# Altium project 28PinArduino.PrjPCB (part 2 of 3)
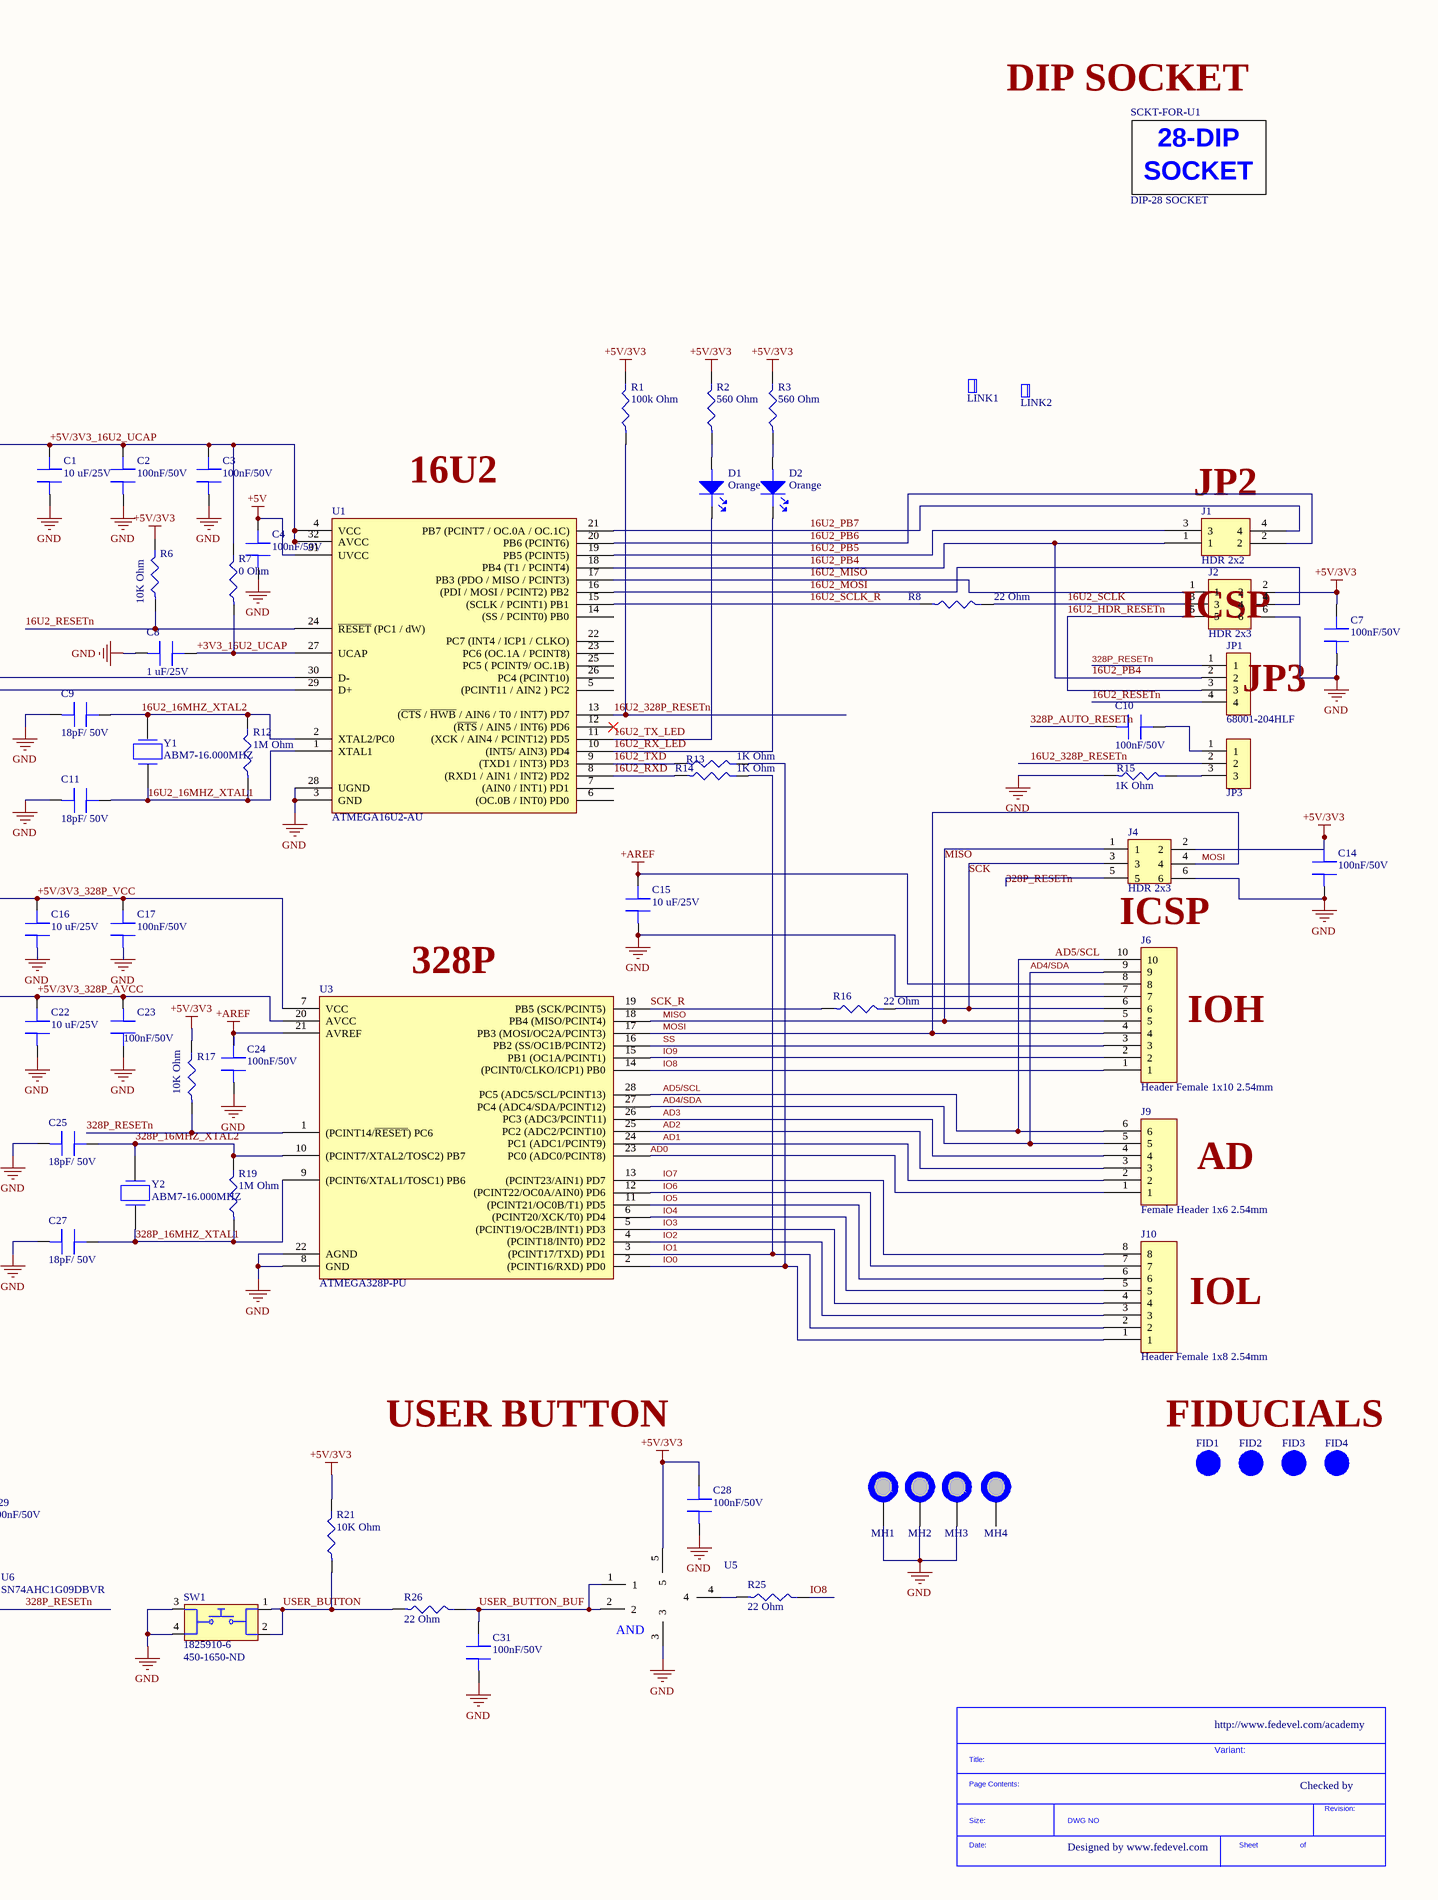
[diagram p5: [03] - 28PINS SCHEMATIC.SchDoc, right]

## Sheet [03] - 28PINS SCHEMATIC.SchDoc: 28 Pins (continued)
### Library data of the parts
C1 C12 C13 C15 C16 C21 C22 = C2012X5R1E106K125AB: TDK - C2012X5R1E106K125AB - Keramikvielschichtkondensator, SMD, 10 µF, 25 V, 0805 [Metrisch 2012], ± 10%, X5R, Baureihe C; Dielectric Material: Ceramic; Capacitance: 10uF; Voltage Rating: 25V; Supplier 1: Digi-Key; Manufacturer: TDK; Manufacturer Part Number: C2012X5R1E106K125AB; Stock 1: 101054; Pricing 1: 1=0.33, 10=0.231, 50=0.1618, 100=0.1386, 500=0.10396, 1000=0.08778 (USD); Mount: Surface Mount; Case/Package: 0805; Case Code (Metric): 2012; Case Code (Imperial): 0805; Weight: 0.000194oz; Min Operating Temperature: -55°C; Max Operating Temperature: 85°C; Tolerance: 10%; Packaging: Tape and Reel; Voltage Rating (DC): 25V; Package Quantity: 1; Dielectric: X5R; Termination: SMD/SMT; Resistor Type: Ceramic; Voltage: 25V; Series: C; Length: 2mm; Width: 0.049inch; Height: 1.25mm; Thickness: 0.057inch; Depth: 1.25mm; REACH SVHC: No SVHC; Lead Free: Lead Free; ComponentLink1URL: http://www.farnell.com/datasheets/1913358.pdf?src-supplier=Element14; ComponentLink1Description: http://www.farnell.com/datasheets/1913358.pdf?src-supplier=Element14; ComponentLink2URL: http://www.tdk.com/pdf/general_B11.pdf?src-supplier=Future+Electronics; ComponentLink2Description: http://www.tdk.com/pdf/general_B11.pdf?src-supplier=Future+Electronics; ComponentLink3URL: http://www.mouser.com/ds/2/400/lcc_commercial_general_en-837201.pdf?src-supplier=Mouser; ComponentLink3Description: http://www.mouser.com/ds/2/400/lcc_commercial_general_en-837201.pdf?src-supplier=Mouser; Supplier Part Number 1: 445-5984-1-ND
C2-C4 C7 C10 C14 C17-C20 C23 C24 C26 C28-C33 = C2012X7R1H104K085AA: TDK - C2012X7R1H104K085AA - SMD Multilayer Ceramic Capacitor, 0.1 µF, 50 V, 0805 [2012 Metric], ± 10%, X7R, C Series; Capacitance: 100nF; Voltage Rating: 50V; Supplier 1: Digi-Key; Manufacturer: TDK; Manufacturer Part Number: C2012X7R1H104K085AA; Stock 1: 405421; Pricing 1: 1=0.15, 10=0.104, 50=0.059, 100=0.0488, 500=0.03422, 1000=0.02833 (USD); Mount: Surface Mount; Case/Package: 0805; Number of Pins: 2; Case Code (Metric): 2012; Case Code (Imperial): 0805; Weight: 0.000194oz; Dielectric Material: Ceramic; Min Operating Temperature: -55°C; Max Operating Temperature: 125°C; Package Quantity: 1; Tolerance: 10%; Packaging: Tape and Reel; Voltage Rating (DC): 50V; Dielectric: X7R; Termination: SMD/SMT; Resistor Type: Ceramic; Voltage: 50V; Series: C; Construction: Flat; Length: 2mm; Width: 0.049inch; Height: 0.85mm; Thickness: 0.037inch; Depth: 1.25mm; Radiation Hardening: No; REACH SVHC: No SVHC; Lead Free: Lead Free; ComponentLink1URL: http://uk.rs-online.com/webdocs/1532/0900766b81532cd0.pdf?src-supplier=RSComponents; ComponentLink1Description: http://uk.rs-online.com/webdocs/1532/0900766b81532cd0.pdf?src-supplier=RSComponents; ComponentLink2URL: https://product.tdk.com/info/en/catalog/datasheets/mlcc_commercial_general_en.pdf?src-supplier=Digi-Key; ComponentLink2Description: https://product.tdk.com/info/en/catalog/datasheets/mlcc_commercial_general_en.pdf?src-supplier=Digi-Key; ComponentLink3URL: http://www.tdk.co.jp/tefe02/e412_c.pdf?src-supplier=Future+Electronics; ComponentLink3Description: http://www.tdk.co.jp/tefe02/e412_c.pdf?src-supplier=Future+Electronics; ComponentLink4URL: http://www.farnell.com/datasheets/1796654.pdf?src-supplier=Newark; ComponentLink4Description: http://www.farnell.com/datasheets/1796654.pdf?src-supplier=Newark; ComponentLink5URL: http://www.farnell.com/datasheets/1571323.pdf?src-supplier=Element14; ComponentLink5Description: http://www.farnell.com/datasheets/1571323.pdf?src-supplier=Element14; Supplier Part Number 1: 445-7534-1-ND
C5 C6 = EEE-1AA101WR: Cap Aluminum 100uF 10V 20% (5 X 5.4mm) SMD 50mA 1000 hr 85°C T/R; Manufacturer: Panasonic; Life (Hours): 1000Hour; Supplier 1: Digi-Key; Manufacturer Part Number: EEE-1AA101WR; Stock 1: 88008; Pricing 1: 1=0.35, 10=0.243, 50=0.1618, 100=0.1374, 500=0.09702 (USD); Mount: Surface Mount,PCB; Case/Package: Radial; Contact Plating: Tin; Min Operating Temperature: -40°C; Max Operating Temperature: 85°C; Capacitance: 100uF; Tolerance: 20%; Ripple Current: 50mA; Voltage Rating: 10V; Packaging: Tape and Reel; Package Quantity: 1; Voltage Rating (DC): 10V; Termination: SMD/SMT; Ripple Current (AC): 50mA; Series: S; Construction: Cylindrical; Diameter: 5mm; Length: 5.5mm; Height: 5.4mm; Height - Seated (Max): 0.213inch; Radiation Hardening: No; Lead Free: Lead Free; RoHS Compliant: Yes; REACH SVHC: Unknown; ComponentLink1URL: https://industrial.panasonic.com/cdbs/www-data/pdf/RDE0000/DME0000COL90.pdf?src-supplier=Avnet; ComponentLink1Description: https://industrial.panasonic.com/cdbs/www-data/pdf/RDE0000/DME0000COL90.pdf?src-supplier=Avnet; ComponentLink2URL: https://industrial.panasonic.com/cdbs/www-data/pdf/RDE0000/DME0000COL90.pdf?src-supplier=Mouser; ComponentLink2Description: https://industrial.panasonic.com/cdbs/www-data/pdf/RDE0000/DME0000COL90.pdf?src-supplier=Mouser; ComponentLink3URL: http://industrial.panasonic.com/www-data/pdf/ABA0000/ABA0000CE2.pdf?src-supplier=Future+Electronics; ComponentLink3Description: http://industrial.panasonic.com/www-data/pdf/ABA0000/ABA0000CE2.pdf?src-supplier=Future+Electronics; ComponentLink4URL: https://industrial.panasonic.com/cdbs/www-data/pdf/RDE0000/DME0000COL90.pdf?src-supplier=Allied+Electronics; ComponentLink4Description: https://industrial.panasonic.com/cdbs/www-data/pdf/RDE0000/DME0000COL90.pdf?src-supplier=Allied+Electronics; ComponentLink5URL: https://industrial.panasonic.com/cdbs/www-data/pdf/RDE0000/DME0000COL90.pdf?src-supplier=Verical; ComponentLink5Description: https://industrial.panasonic.com/cdbs/www-data/pdf/RDE0000/DME0000COL90.pdf?src-supplier=Verical; Supplier Part Number 1: PCE3867CT-ND
C8 = C2012X5R1E105K125AA: TDK - C2012X5R1E105K125AA - SMD Multilayer Ceramic Capacitor, 1 µF, 25 V, 0805 [2012 Metric], ± 10%, X5R, C Series; Capacitance: 1uF; Voltage Rating: 25V; Supplier 1: Digi-Key; Manufacturer: TDK; Manufacturer Part Number: C2012X5R1E105K125AA; Stock 1: 63925; Pricing 1: 1=0.23, 10=0.158, 50=0.095, 100=0.0803, 500=0.05492, 1000=0.04858 (USD); Mount: Surface Mount; Case/Package: 0805; Number of Pins: 2; Case Code (Metric): 2012; Case Code (Imperial): 0805; Dielectric Material: Ceramic; Weight: 0.000194oz; Min Operating Temperature: -55°C; Max Operating Temperature: 85°C; Tolerance: 10%; Packaging: Tape and Reel; Voltage Rating (DC): 25V; Dielectric: X5R; Termination: SMD/SMT; Construction: Flat; Package Quantity: 2000; Resistor Type: Ceramic; Voltage: 25V; Series: C; Length: 2mm; Width: 0.049inch; Height: 1.25mm; Depth: 1.25mm; Thickness: 0.057inch; Radiation Hardening: No; Lead Free: Lead Free; REACH SVHC: No SVHC; ComponentLink1URL: http://uk.rs-online.com/webdocs/1532/0900766b81532cd0.pdf?src-supplier=RSComponents; ComponentLink1Description: http://uk.rs-online.com/webdocs/1532/0900766b81532cd0.pdf?src-supplier=RSComponents; ComponentLink2URL: http://www.tdk.co.jp/tefe02/e412_c.pdf?src-supplier=Future+Electronics; ComponentLink2Description: http://www.tdk.co.jp/tefe02/e412_c.pdf?src-supplier=Future+Electronics; ComponentLink3URL: http://www.farnell.com/datasheets/1744655.pdf?src-supplier=Element14; ComponentLink3Description: http://www.farnell.com/datasheets/1744655.pdf?src-supplier=Element14; ComponentLink4URL: https://product.tdk.com/info/en/catalog/spec/mlccspec_commercial_general_midvoltage_en.pdf?src-supplier=Verical; ComponentLink4Description: https://product.tdk.com/info/en/catalog/spec/mlccspec_commercial_general_midvoltage_en.pdf?src-supplier=Verical; Supplier Part Number 1: 445-1419-1-ND
C9 C11 C25 C27 = C0805C180J5GACTU: CAP CER 18PF 50V C0G/NP0 0805; Manufacturer: KEMET; Dielectric Material: Ceramic; Tolerance: 5%; Dielectric: C0G; Temperature Coefficient: 30ppm/°C; Dissipation Factor: 0.1%; Supplier 1: Digi-Key; Manufacturer Part Number: C0805C180J5GACTU; Stock 1: 98283; Pricing 1: 1=0.12, 10=0.086, 50=0.049, 100=0.0407, 500=0.02852, 1000=0.02361 (USD); Mount: Surface Mount,PCB; Case/Package: 0805; Number of Pins: 2; Contact Plating: Tin,Matte; Contact Material: Tin; Case Code (Imperial): 0805; Case Code (Metric): 2012; Min Operating Temperature: -55°C; Max Operating Temperature: 125°C; Capacitance: 18pF; Packaging: Tape and Reel; Voltage: 50V; Termination: SMD/SMT; Voltage Rating (DC): 50V; Package Quantity: 1; Voltage Rating: 50V; Series: C; Construction: Flat; Length: 2mm; Width: 1.2mm; Height: 0.78mm; Depth: 1.25mm; Lead Pitch: 0.75mm; Thickness: 0.035inch; Radiation Hardening: No; Lead Free: Lead Free; REACH SVHC: No SVHC; ComponentLink1URL: http://www.farnell.com/datasheets/1769375.pdf?src-supplier=Element14; ComponentLink1Description: http://www.farnell.com/datasheets/1769375.pdf?src-supplier=Element14; ComponentLink2URL: https://www.verical.com/server-webapp/html/getDatasheet?partID=385668&src-supplier=Verical; ComponentLink2Description: https://www.verical.com/server-webapp/html/getDatasheet?partID=385668&src-supplier=Verical; ComponentLink3URL: https://www.verical.com/server-webapp/html/getDatasheet?partID=759702&src-supplier=Verical; ComponentLink3Description: https://www.verical.com/server-webapp/html/getDatasheet?partID=759702&src-supplier=Verical; Supplier Part Number 1: 399-1112-1-ND
D1-D3 = LOL29K-H2K1-24-Z: OSRAM - LO L29K-H2K1-24-Z - SMARTLED 0603 ORANGE; Manufacturer: Osram Opto; Lens Color: White; Forward Current: 20mA; Forward Voltage: 2.2V; Luminous Intensity: 9mcd; Viewing Angle: 160°; Lens Style: Flat,Diffused,Colorless,Rectangular; Test Current: 2mA; Dominant Wavelength: 606nm; Luminous Flux: 0.025lm; Number of LEDs: 1; Reverse Voltage: 12V; Lens Transparency: Diffused; Lens Size: 0.8mm; Supplier 1: Digi-Key; Manufacturer Part Number: LOL29K-H2K1-24-Z; Stock 1: 0; Mount: Surface Mount; Case/Package: 0603; Number of Pins: 2; Color: Orange; Case Code (Metric): 1608; Case Code (Imperial): 0603; Min Operating Temperature: -40°C; Max Operating Temperature: 100°C; Packaging: Tape and Reel; Number of Elements: 1; Series: SmartLED; Illumination Color: Orange; Package Quantity: 5000; Length: 1.3mm; Width: 0.8mm; Height: 0.65mm; Depth: 0.8mm; Radiation Hardening: No; ComponentLink1URL: https://dammedia.osram.info/media/resource/hires/osram-dam-2493882/LO%20L29K.pdf?src-supplier=Digi-Key; ComponentLink1Description: https://dammedia.osram.info/media/resource/hires/osram-dam-2493882/LO%20L29K.pdf?src-supplier=Digi-Key; ComponentLink2URL: https://www.verical.com/server-webapp/html/getDatasheet?partID=693885&src-supplier=Verical; ComponentLink2Description: https://www.verical.com/server-webapp/html/getDatasheet?partID=693885&src-supplier=Verical; Supplier Part Number 1: 475-2740-6-ND
D4 = LGL29K-G2J1-24-Z: LED Uni-Color Green 572nm 2-Pin Chip 0603(1608Metric) T/R; Manufacturer: Osram Opto; Lens Color: White; Forward Current: 20mA; Forward Voltage: 2.2V; Luminous Intensity: 5.6mcd; Viewing Angle: 160°; Lens Style: Flat,Diffused,Colorless,Rectangular; Test Current: 2mA; Dominant Wavelength: 570nm; Luminous Flux: 0.012lm; Number of LEDs: 1; Lens Transparency: Diffused; Reverse Voltage: 12V; Lens Size: 0.8mm; Supplier 1: Digi-Key; Manufacturer Part Number: LGL29K-G2J1-24-Z; Stock 1: 114683; Pricing 1: 1=0.47, 10=0.308, 100=0.2053, 500=0.14198, 1000=0.11832, 2000=0.10649 (USD); Mount: Surface Mount; Case/Package: 0603; Number of Pins: 2; Color: Green; Case Code (Metric): 1608; Case Code (Imperial): 0603; Min Operating Temperature: -40°C; Max Operating Temperature: 100°C; Illumination Color: Green; Packaging: Tape and Reel; Package Quantity: 5000; Number of Elements: 1; Series: SmartLED; Length: 1.3mm; Width: 0.8mm; Height: 0.65mm; Depth: 0.8mm; Radiation Hardening: No; ComponentLink1URL: http://www.mouser.com/ds/2/311/LG%20L29K%20-%20SMARTLED%200603-335234.pdf?src-supplier=Mouser; ComponentLink1Description: http://www.mouser.com/ds/2/311/LG%20L29K%20-%20SMARTLED%200603-335234.pdf?src-supplier=Mouser; ComponentLink2URL: https://dammedia.osram.info/media/resource/hires/osram-dam-2493945/LG%20L29K.pdf?src-supplier=Digi-Key; ComponentLink2Description: https://dammedia.osram.info/media/resource/hires/osram-dam-2493945/LG%20L29K.pdf?src-supplier=Digi-Key; ComponentLink3URL: https://www.verical.com/server-webapp/html/getDatasheet?partID=571127&src-supplier=Verical; ComponentLink3Description: https://www.verical.com/server-webapp/html/getDatasheet?partID=571127&src-supplier=Verical; Supplier Part Number 1: 475-2709-1-ND
D5 D6 = BAT54HT1G: Small Signal Schottky Diode, Single, 30 V, 200 mA, 800 mV, 600 mA, 150 C ;RoHS Compliant: Yes; Manufacturer: ON Semiconductor / Fairchild; Forward Voltage: 800mV; Forward Current: 200mA; Recovery Time: 5ns; Max Repetitive Reverse Voltage (Vrrm): 30V; Peak Non-Repetitive Surge Current: 600mA; Max Reverse Current: 2uA; Power Dissipation: 200mW; Polarity: Standard; Capacitance: 10pF; Supplier 1: Digi-Key; Manufacturer Part Number: BAT54HT1G; Stock 1: 286260; Pricing 1: 1=0.2, 10=0.141, 100=0.0759, 500=0.05962, 1000=0.0414 (USD); Mount: Surface Mount; Number of Pins: 2; Contact Plating: Tin,Matte; Min Operating Temperature: -55°C; Max Operating Temperature: 150°C; Packaging: Tape and Reel; Package Quantity: 3000; Average Rectified Current: 200mA; Reverse Recovery Time: 5ns; Max Forward Surge Current (Ifsm): 600mA; Element Configuration: Single; Max Reverse Voltage (DC): 30V; Max Surge Current: 600mA; Voltage Rating (DC): 30V; Current Rating: 200mA; Output Current: 200mA; Reverse Voltage: 30V; Max Reverse Leakage Current: 2uA; Length: 1.8mm; Width: 1.35mm; Height: 1mm; Radiation Hardening: No; Lead Free: Lead Free; REACH SVHC: No SVHC; ComponentLink1URL: http://www.fairchildsemi.com/datasheets/BA/BAT54HT1G.pdf?src-supplier=Digi-Key; ComponentLink1Description: http://www.fairchildsemi.com/datasheets/BA/BAT54HT1G.pdf?src-supplier=Digi-Key; ComponentLink2URL: http://www.farnell.com/datasheets/2251626.pdf?src-supplier=Element14; ComponentLink2Description: http://www.farnell.com/datasheets/2251626.pdf?src-supplier=Element14; ComponentLink3URL: http://www.jameco.com/Jameco/Products/ProdDS/806549.pdf?src-supplier=Jameco; ComponentLink3Description: http://www.jameco.com/Jameco/Products/ProdDS/806549.pdf?src-supplier=Jameco; ComponentLink4URL: http://www.farnell.com/datasheets/2251626.pdf?src-supplier=Newark; ComponentLink4Description: http://www.farnell.com/datasheets/2251626.pdf?src-supplier=Newark; ComponentLink5URL: http://www.mouser.com/ds/2/149/BAT54HT1G-104602.pdf?src-supplier=Mouser; ComponentLink5Description: http://www.mouser.com/ds/2/149/BAT54HT1G-104602.pdf?src-supplier=Mouser; ComponentLink6URL: http://www.farnell.com/datasheets/1727620.pdf?src-supplier=Element14; ComponentLink6Description: http://www.farnell.com/datasheets/1727620.pdf?src-supplier=Element14; ComponentLink7URL: https://media.digikey.com/pdf/Data%20Sheets/Fairchild%20PDFs/BAT54HT1G_Rev_1.2.pdf?src-supplier=Avnet; ComponentLink7Description: https://media.digikey.com/pdf/Data%20Sheets/Fairchild%20PDFs/BAT54HT1G_Rev_1.2.pdf?src-supplier=Avnet; ComponentLink8URL: http://www.onsemi.com/pub/Collateral/BAT54HT1-D.PDF?src-supplier=Avnet; ComponentLink8Description: http://www.onsemi.com/pub/Collateral/BAT54HT1-D.PDF?src-supplier=Avnet; ComponentLink9URL: http://www.onsemi.com/pub/Collateral/BAT54HT1-D.PDF?src-supplier=Digi-Key; ComponentLink9Description: http://www.onsemi.com/pub/Collateral/BAT54HT1-D.PDF?src-supplier=Digi-Key; ComponentLink10URL: http://uk.rs-online.com/webdocs/11a6/0900766b811a63a9.pdf?src-supplier=RSComponents; ComponentLink10Description: http://uk.rs-online.com/webdocs/11a6/0900766b811a63a9.pdf?src-supplier=RSComponents; ComponentLink11URL: https://media.digikey.com/pdf/Data%20Sheets/Fairchild%20PDFs/BAT54HT1G_Rev_1.2.pdf?src-supplier=Mouser; ComponentLink11Description: https://media.digikey.com/pdf/Data%20Sheets/Fairchild%20PDFs/BAT54HT1G_Rev_1.2.pdf?src-supplier=Mouser; ComponentLink12URL: http://www.fairchildsemi.com/ds/BA/BAT54HT1G.pdf?src-supplier=Future+Electronics; ComponentLink12Description: http://www.fairchildsemi.com/ds/BA/BAT54HT1G.pdf?src-supplier=Future+Electronics; ComponentLink13URL: http://www.produktinfo.conrad.com/datenblaetter/1200000-1299999/001262925-da-01-en-DIODE_SCHOTTKY_30V_BAT54HT1G_SOD_323_FSC.pdf?src-supplier=Conrad; ComponentLink13Description: http://www.produktinfo.conrad.com/datenblaetter/1200000-1299999/001262925-da-01-en-DIODE_SCHOTTKY_30V_BAT54HT1G_SOD_323_FSC.pdf?src-supplier=Conrad; Supplier Part Number 1: BAT54HT1GOSCT-ND
FB1-FB3 = MPZ2012S601AT000: FERRITE BEAD 600 OHM 0805 1LN; Manufacturer: TDK; Impedance: 600R; Current Rating: 2A; DC Resistance (DCR): 100mR; Supplier 1: Digi-Key; Manufacturer Part Number: MPZ2012S601AT000; Stock 1: 186163; Pricing 1: 1=0.11, 10=0.092, 25=0.0824, 50=0.0604, 100=0.0522, 250=0.04116, 500=0.03478, 1000=0.02928 (USD); Mount: Surface Mount; Case/Package: 0805; Case Code (Metric): 2012; Case Code (Imperial): 0805; Packaging: Tape and Reel; Package Quantity: 1; Max DC Current: 2A; Series: MPZ; Length: 0.079inch; Width: 0.049inch; Height: 0.041inch; REACH SVHC: No SVHC; Lead Free: Lead Free; ComponentLink1URL: https://media.digikey.com/pdf/Data%20Sheets/TDK%20PDFs/MPZ_Series_Br.pdf?src-supplier=Digi-Key; ComponentLink1Description: https://media.digikey.com/pdf/Data%20Sheets/TDK%20PDFs/MPZ_Series_Br.pdf?src-supplier=Digi-Key; ComponentLink2URL: https://product.tdk.com/info/en/catalog/datasheets/beads_commercial_power_mpz2012_en.pdf?src-supplier=Digi-Key; ComponentLink2Description: https://product.tdk.com/info/en/catalog/datasheets/beads_commercial_power_mpz2012_en.pdf?src-supplier=Digi-Key; Supplier Part Number 1: 445-2206-1-ND
FID1-FID4 = FID_1mm: Fiducial 40 mil Diameter 120mil Mask
J1 = 68602-204HLF: Manufacturer: Amphenol ICC / FCI; Supplier 1: Digi-Key; Manufacturer Part Number: 68602-204HLF; Stock 1: 1451; Pricing 1: 1=0.34, 10=0.319, 100=0.2232, 500=0.19132, 1000=0.15943, 5000=0.13665, 10000=0.12754 (USD); Supplier Part Number 1: 609-3369-ND
J2 J4 = 67997-106HLF: CONN HEADER 6POS .100 STR 30AU; Manufacturer: Amphenol FCI; Current Rating: 3A; Voltage Rating: 1.5kV; Number of Positions: 6; Insulation Resistance: 5GR; Gender: Male; Connector Type: Male Pin; Pitch: 2.54mm; Row Spacing: 0.1inch; Contact Post Length: 3.05mm; Supplier 1: Digi-Key; Manufacturer Part Number: 67997-106HLF; Stock 1: 1209; Pricing 1: 1=1.78, 10=1.614, 100=1.3837, 500=1.15308, 1000=0.98835, 5000=0.87634, 10000=0.85657 (USD); Mount: Through Hole; Contact Plating: Gold,GXT; Contact Material: Bronze; Color: Black; Housing Color: Black; Housing Material: Thermoplastic; Min Operating Temperature: -65°C; Max Operating Temperature: 125°C; Packaging: Bulk; Number of Rows: 2; Package Quantity: 100; Contact Gender: Male; Termination: Through Hole; Number of Contacts: 6; Max Voltage Rating (AC): 1.5kV; Orientation: Straight; Series: 67997; Contact Type: Male Pin; Length: 7.62mm; Contact Mating Length: 0.23inch; Depth: 4.83mm; Radiation Hardening: No; REACH SVHC: No SVHC; Lead Free: Lead Free; Flammability Rating: UL94 V-0; ComponentLink1URL: https://cdn.amphenol-icc.com/media/wysiwyg/files/drawing/67996.pdf?src-supplier=Avnet; ComponentLink1Description: https://cdn.amphenol-icc.com/media/wysiwyg/files/drawing/67996.pdf?src-supplier=Avnet; ComponentLink2URL: https://cdn.amphenol-icc.com/media/wysiwyg/files/drawing/67996.pdf?src-supplier=Digi-Key; ComponentLink2Description: https://cdn.amphenol-icc.com/media/wysiwyg/files/drawing/67996.pdf?src-supplier=Digi-Key; ComponentLink3URL: https://cdn.amphenol-icc.com/media/wysiwyg/files/drawing/67996.pdf?src-supplier=Mouser; ComponentLink3Description: https://cdn.amphenol-icc.com/media/wysiwyg/files/drawing/67996.pdf?src-supplier=Mouser; ComponentLink4URL: https://cdn.amphenol-icc.com/media/wysiwyg/files/drawing/67996.pdf?src-supplier=Avnet+Europe; ComponentLink4Description: https://cdn.amphenol-icc.com/media/wysiwyg/files/drawing/67996.pdf?src-supplier=Avnet+Europe; Supplier Part Number 1: 609-3393-ND
J3 = 10118193-0001LF: CONN USB MICRO B RECPT SMT R/A; Manufacturer: Amphenol FCI; Number of Terminals/Pins: 5; Gender: Female; Connector Type: USB,Receptacle; Number of Ports: 1; Current Rating: 1.8A; Insulation Resistance: 1GR; Max Voltage Rating (AC): 100V; Pitch: 0.65mm; Supplier 1: Digi-Key; Manufacturer Part Number: 10118193-0001LF; Stock 1: 7229; Pricing 1: 1=0.48, 10=0.451, 25=0.3868, 50=0.3286, 100=0.3158, 250=0.2836, 500=0.2707 (USD); Mount: Surface Mount,Horizontal; Contact Plating: Gold; Contact Material: Copper Alloy; Color: Black; Housing Material: Polymer; Min Operating Temperature: -55°C; Max Operating Temperature: 85°C; Termination: Solder; Packaging: Tape and Reel; Number of Contacts: 5; Orientation: Right Angle; Package Quantity: 1200; Voltage Rating: 100V; Features: Shielded; Series: -; Length: 7.86mm; Depth: 5.67mm; Radiation Hardening: No; Flammability Rating: UL94 V-0; ComponentLink1URL: https://cdn.amphenol-icc.com/media/wysiwyg/files/documentation/datasheet/inputoutput/io_usb_micro.pdf?src-supplier=Digi-Key; ComponentLink1Description: https://cdn.amphenol-icc.com/media/wysiwyg/files/documentation/datasheet/inputoutput/io_usb_micro.pdf?src-supplier=Digi-Key; ComponentLink2URL: https://cdn.amphenol-icc.com/media/wysiwyg/files/documentation/datasheet/inputoutput/io_usb_micro.pdf?src-supplier=Arrow+Electronics; ComponentLink2Description: https://cdn.amphenol-icc.com/media/wysiwyg/files/documentation/datasheet/inputoutput/io_usb_micro.pdf?src-supplier=Arrow+Electronics; ComponentLink3URL: http://www.amphenol-icc.com/media/wysiwyg/files/drawing/10118193.pdf?src-supplier=Digi-Key; ComponentLink3Description: http://www.amphenol-icc.com/media/wysiwyg/files/drawing/10118193.pdf?src-supplier=Digi-Key; ComponentLink4URL: https://cdn.amphenol-icc.com/media/wysiwyg/files/documentation/datasheet/inputoutput/io_usb_micro.pdf?src-supplier=Verical; ComponentLink4Description: https://cdn.amphenol-icc.com/media/wysiwyg/files/documentation/datasheet/inputoutput/io_usb_micro.pdf?src-supplier=Verical; ComponentLink5URL: https://cdn.amphenol-icc.com/media/wysiwyg/files/documentation/datasheet/inputoutput/io_usb_micro.pdf?src-supplier=Allied+Electronics; ComponentLink5Description: https://cdn.amphenol-icc.com/media/wysiwyg/files/documentation/datasheet/inputoutput/io_usb_micro.pdf?src-supplier=Allied+Electronics; ComponentLink6URL: https://cdn.amphenol-icc.com/media/wysiwyg/files/documentation/datasheet/inputoutput/io_usb_micro.pdf?src-supplier=Mouser; ComponentLink6Description: https://cdn.amphenol-icc.com/media/wysiwyg/files/documentation/datasheet/inputoutput/io_usb_micro.pdf?src-supplier=Mouser; Supplier Part Number 1: 609-4616-1-ND
J5 J7 = PAD_WITH_HOLE: Pad with a hole
J6 = M20-7821046: HARWIN - M20-7821046 - Board-To-Board Connector, M20 Series, Through Hole, Receptacle, 10, 2.54 mm, Tin Plated Contacts; Current Rating: 3A; Number of Positions: 10; Contact Resistance: 20mR; Insulation Resistance: 1MR; Mating Cycles: 50; Hole Diameter: 0.8mm; Supplier 1: Digi-Key; Manufacturer: Harwin; Manufacturer Part Number: M20-7821046; Stock 1: 645; Pricing 1: 1=1.13, 10=0.997, 100=0.8602, 500=0.7038, 1000=0.6256, 5000=0.5474, 10000=0.52003 (USD); Mount: Through Hole; Case/Package: SIL; Color: Black; Contact Plating: Tin; Contact Material: Bronze; Housing Material: Polyamide; Housing Color: Black; Min Operating Temperature: -40°C; Max Operating Temperature: 105°C; Packaging: Rail/Tube; Number of Rows: 1; Package Quantity: 23; Connector Type: Receptacle; Termination: Solder; Series: M20; Contact Type: Female Socket; Number of Contacts: 10; Gender: Receptacle; Max Current Rating: 3A; Orientation: Straight; Contact Gender: Female; Length: 25.8mm; Pitch: 2.54mm; Depth: 2.5mm; Lead Pitch: 2.54mm; Radiation Hardening: No; REACH SVHC: No SVHC; ComponentLink1URL: https://www.verical.com/server-webapp/html/getDatasheet?partID=559226&src-supplier=Verical; ComponentLink1Description: https://www.verical.com/server-webapp/html/getDatasheet?partID=559226&src-supplier=Verical; ComponentLink2URL: https://cdn.harwin.com/pdfs/M20-782.pdf?src-supplier=Digi-Key; ComponentLink2Description: https://cdn.harwin.com/pdfs/M20-782.pdf?src-supplier=Digi-Key; ComponentLink3URL: http://www.harwin.com/include/downloads/drawings/M20-782.PDF?src-supplier=Avnet; ComponentLink3Description: http://www.harwin.com/include/downloads/drawings/M20-782.PDF?src-supplier=Avnet; ComponentLink4URL: https://cdn.harwin.com/pdfs/Harwin_PC_Connectors_M20.pdf?src-supplier=Avnet+Europe; ComponentLink4Description: https://cdn.harwin.com/pdfs/Harwin_PC_Connectors_M20.pdf?src-supplier=Avnet+Europe; ComponentLink5URL: http://uk.rs-online.com/webdocs/1422/0900766b81422659.pdf?src-supplier=RSComponents; ComponentLink5Description: http://uk.rs-online.com/webdocs/1422/0900766b81422659.pdf?src-supplier=RSComponents; Supplier Part Number 1: 952-1847-ND
J8 J10 = M20-7820842: 2.54mm (0.1") Pitch SIL Vertical PC Tail Socket Assembly, selective gold + tin, 8 contacts; Manufacturer: Harwin; Number of Contacts: 8; Max Current Rating: 3A; Contact Resistance: 20mR; Connector Type: Receptacle; Supplier 1: Digi-Key; Manufacturer Part Number: M20-7820842; Stock 1: 344; Pricing 1: 1=1.17, 10=1.03, 100=0.8888, 500=0.7272, 1000=0.6464, 5000=0.5656, 10000=0.53732 (USD); Mount: Through Hole; Case/Package: SIL; Contact Plating: Tin,Gold; Color: Black; Contact Material: Bronze; Weight: 0.025397oz; Housing Color: Black; Housing Material: Polyamide; Min Operating Temperature: -40°C; Max Operating Temperature: 105°C; Number of Rows: 1; Termination: Solder; Contact Gender: Female; Package Quantity: 29; Packaging: Rail/Tube; Number of Positions: 8; Orientation: Straight; Gender: Female; Series: M20; Contact Type: Female Socket; Length: 20.72mm; Pitch: 2.54mm; Depth: 2.5mm; Radiation Hardening: No; ComponentLink1URL: https://cdn.harwin.com/pdfs/Harwin_PC_Connectors_M20.pdf?src-supplier=Avnet+Europe; ComponentLink1Description: https://cdn.harwin.com/pdfs/Harwin_PC_Connectors_M20.pdf?src-supplier=Avnet+Europe; ComponentLink2URL: http://www.harwin.com/include/downloads/drawings/M20-782.PDF?src-supplier=Avnet; ComponentLink2Description: http://www.harwin.com/include/downloads/drawings/M20-782.PDF?src-supplier=Avnet; Supplier Part Number 1: 952-1823-ND
J9 = M20-7820646: 06-WAY SIL VERT SOCKET L/FREE; Manufacturer: Harwin; Number of Contacts: 6; Max Current Rating: 3A; Contact Resistance: 20mR; Connector Type: Receptacle; Supplier 1: Digi-Key; Manufacturer Part Number: M20-7820646; Stock 1: 1716; Pricing 1: 1=1.01, 10=0.89, 100=0.7678, 500=0.6282, 1000=0.5584, 5000=0.4886, 10000=0.46417 (USD); Mount: Through Hole; Case/Package: SIL; Color: Black; Contact Plating: Tin; Contact Material: Bronze; Housing Color: Black; Housing Material: Nylon; Min Operating Temperature: -40°C; Max Operating Temperature: 105°C; Number of Rows: 1; Termination: Solder; Packaging: Rail/Tube; Contact Gender: Female; Package Quantity: 38; Number of Positions: 6; Orientation: Straight; Gender: Female; Series: M20; Contact Type: Female Socket; Length: 15.64mm; Pitch: 2.54mm; Depth: 2.5mm; Radiation Hardening: No; ComponentLink1URL: http://www.harwin.com/include/downloads/pdfs/2010PAGE120.PDF?src-supplier=Avnet; ComponentLink1Description: http://www.harwin.com/include/downloads/pdfs/2010PAGE120.PDF?src-supplier=Avnet; ComponentLink2URL: https://cdn.harwin.com/pdfs/M20-782.pdf?src-supplier=Newark; ComponentLink2Description: https://cdn.harwin.com/pdfs/M20-782.pdf?src-supplier=Newark; ComponentLink3URL: https://cdn.harwin.com/pdfs/M20-782.pdf?src-supplier=Digi-Key; ComponentLink3Description: https://cdn.harwin.com/pdfs/M20-782.pdf?src-supplier=Digi-Key; ComponentLink4URL: http://components.arrow.com/part/dataview/0323_00725884?src-supplier=Arrow+Europe; ComponentLink4Description: http://components.arrow.com/part/dataview/0323_00725884?src-supplier=Arrow+Europe; ComponentLink5URL: https://cdn.harwin.com/pdfs/Harwin_PC_Connectors_M20.pdf?src-supplier=Avnet+Europe; ComponentLink5Description: https://cdn.harwin.com/pdfs/Harwin_PC_Connectors_M20.pdf?src-supplier=Avnet+Europe; ComponentLink6URL: https://cdn.harwin.com/pdfs/Harwin_PC_Connectors_M20.pdf?src-supplier=Mouser; ComponentLink6Description: https://cdn.harwin.com/pdfs/Harwin_PC_Connectors_M20.pdf?src-supplier=Mouser; ComponentLink7URL: https://cdn.harwin.com/pdfs/Harwin_PC_Connectors_M20.pdf?src-supplier=RSComponents; ComponentLink7Description: https://cdn.harwin.com/pdfs/Harwin_PC_Connectors_M20.pdf?src-supplier=RSComponents; ComponentLink8URL: https://cdn.harwin.com/pdfs/M20-782.pdf?src-supplier=Farnell; ComponentLink8Description: https://cdn.harwin.com/pdfs/M20-782.pdf?src-supplier=Farnell; ComponentLink9URL: https://cdn.harwin.com/pdfs/Harwin_PC_Connectors_M20.pdf?src-supplier=TTI; ComponentLink9Description: https://cdn.harwin.com/pdfs/Harwin_PC_Connectors_M20.pdf?src-supplier=TTI; Supplier Part Number 1: 952-1809-ND
JP1 = 68001-204HLF: CONN HEADER VERT 4POS 2.54MM; Manufacturer: Amphenol FCI; Current Rating: 3A; Voltage Rating: 1.5kV; Number of Positions: 4; Insulation Resistance: 5GR; Gender: Male; Connector Type: Male Pin; Contact Post Length: 3.05mm; Supplier 1: Digi-Key; Manufacturer Part Number: 68001-204HLF; Stock 1: 2119; Pricing 1: 1=0.38, 10=0.357, 100=0.2501, 500=0.21442, 1000=0.17868, 5000=0.15315, 10000=0.14294 (USD); Mount: Through Hole; Color: Black; Contact Plating: Gold,GXT; Contact Material: Bronze; Housing Material: Thermoplastic; Min Operating Temperature: -65°C; Max Operating Temperature: 125°C; Package Quantity: 100; Number of Rows: 1; Packaging: Bulk; Contact Gender: Male; Termination: Solder; Number of Contacts: 4; Orientation: Straight; Series: BERGSTIK® II, MezzSelect™, Basics+; Contact Type: Male Pin; Pitch: 2.54mm; Contact Mating Length: 0.23inch; Radiation Hardening: No; Flammability Rating: UL94 V-0; ComponentLink1URL: https://cdn.amphenol-icc.com/media/wysiwyg/files/drawing/68000.pdf?src-supplier=Digi-Key; ComponentLink1Description: https://cdn.amphenol-icc.com/media/wysiwyg/files/drawing/68000.pdf?src-supplier=Digi-Key; ComponentLink2URL: https://cdn.amphenol-icc.com/media/wysiwyg/files/drawing/68000.pdf?src-supplier=Mouser; ComponentLink2Description: https://cdn.amphenol-icc.com/media/wysiwyg/files/drawing/68000.pdf?src-supplier=Mouser; Supplier Part Number 1: 609-3402-ND
JP2 JP3 = 68000-103HLF: AMPHENOL ICC - 68000-103HLF - Board-To-Board Connector, 2.54 mm, 3 Contacts, Header, FCI BergStik II 68000 Series, Through Hole; Supplier 1: Digi-Key; Manufacturer: Amphenol ICC; Manufacturer Part Number: 68000-103HLF; Stock 1: 21447; Pricing 1: 1=0.31, 10=0.292, 100=0.2046, 500=0.17536, 1000=0.14613, 5000=0.12525, 10000=0.1169 (USD); Supplier Part Number 1: 609-3461-ND
L1 = L1210R2R2MDWIT: FIXED IND 2.2UH 2A 80 MOHM SMD; Manufacturer: KEMET; Core Material: Ferrite; Tolerance: 20%; Shielding: Unshielded; Self Resonant Frequency: 190MHz; DC Resistance (DCR): 80mR; Test Frequency: 100kHz; DC Current: 1.13A; Supplier 1: Digi-Key; Manufacturer Part Number: L1210R2R2MDWIT; Stock 1: 14031; Pricing 1: 1=0.48, 10=0.417, 25=0.3868, 50=0.3272, 100=0.2975, 250=0.27964, 500=0.2499 (USD); Mount: Surface Mount; Case/Package: 1210; Case Code (Metric): 3225; Case Code (Imperial): 1210; Min Operating Temperature: -40°C; Max Operating Temperature: 105°C; Inductance: 2.2uH; Max DC Current: 2A; Package Quantity: 1000; Current Rating: 2A; Packaging: Tape and Reel; Inductance Tolerance: 20%; Resistor Type: Wirewound,Ceramic; Termination: SMD/SMT; Series: L-DWI; Length: 0.126inch; Width: 0.098inch; Height: 2.5mm; Height - Seated (Max): 0.106inch; Depth: 2.7mm; Radiation Hardening: No; REACH SVHC: No SVHC; Military Standard: Not; RoHS Compliant: Yes; ComponentLink1URL: https://content.kemet.com/datasheets/F3115.pdf?src-supplier=Mouser; ComponentLink1Description: https://content.kemet.com/datasheets/F3115.pdf?src-supplier=Mouser; ComponentLink2URL: https://content.kemet.com/datasheets/F3115.pdf?src-supplier=Avnet+Europe; ComponentLink2Description: https://content.kemet.com/datasheets/F3115.pdf?src-supplier=Avnet+Europe; ComponentLink3URL: http://www.farnell.com/datasheets/27262.pdf?src-supplier=Element14; ComponentLink3Description: http://www.farnell.com/datasheets/27262.pdf?src-supplier=Element14; ComponentLink4URL: https://api.kemet.com/component-edge/download/datasheet/L1210R2R2MDWIT.pdf?src-supplier=Digi-Key; ComponentLink4Description: https://api.kemet.com/component-edge/download/datasheet/L1210R2R2MDWIT.pdf?src-supplier=Digi-Key; ComponentLink5URL: http://www.kemet.com/Lists/ProductCatalog/Attachments/57/F3115.pdf?src-supplier=Avnet; ComponentLink5Description: http://www.kemet.com/Lists/ProductCatalog/Attachments/57/F3115.pdf?src-supplier=Avnet; Supplier Part Number 1: 399-9598-1-ND
LINK1-LINK3 = QPC02SXGN-RC: CONN JUMPER SHORTING .100" GOLD; Manufacturer: Sullins; Number of Positions: 2; Pitch: 0.1inch; Supplier 1: Digi-Key; Manufacturer Part Number: QPC02SXGN-RC; Stock 1: 990715; Pricing 1: 1=0.1, 25=0.044, 50=0.0378, 250=0.03152, 750=0.02835, 1000=0.02646, 12000=0.02016, 24000=0.01827, 48000=0.0182 (USD); Case/Package: 100; Contact Plating: Gold; Package Quantity: 2000; Packaging: Bulk; Height: 0.235inch; Lead Free: Lead Free; ComponentLink1URL: https://s3.amazonaws.com/catalogspreads-pdf/PAGE128-129%20.100%20JUMPER.pdf?src-supplier=Digi-Key; ComponentLink1Description: https://s3.amazonaws.com/catalogspreads-pdf/PAGE128-129%20.100%20JUMPER.pdf?src-supplier=Digi-Key; Supplier Part Number 1: S9337-ND
MH1-MH3 = MH_7.4MMC_3.2: Mounting Hole 7.4mm diameter, 3.2 mm drill
MH4 = MH_7.4MMNC_3.2MMD: Mounting Hole Non Copper 7.4mm diameter 3mm drill NPTH
R1 = RC0805FR-07100KL (2): YAGEO         RC0805FR-07100KL            RES, THICK FILM, 100K, 1%, 0.125W, 0805, REEL; Resistance: 100kR; Temperature Coefficient: 100ppm/°C; Power Rating: 125mW; Voltage Rating (DC): 150V; Supplier 1: Digi-Key; Manufacturer: Yageo; Manufacturer Part Number: RC0805FR-07100KL; Stock 1: 2207186; Pricing 1: 1=0.1, 10=0.036, 100=0.0147, 1000=0.0066, 2500=0.00573 (USD); Case/Package: 0805; Number of Pins: 2; Case Code (Metric): 2012; Case Code (Imperial): 0805; Size Code: 0805; Min Operating Temperature: -55°C; Max Operating Temperature: 155°C; Resistor Type: Thick Film; Tolerance: 1%; Packaging: Tape and Reel; Voltage Rating: 150V; Package Quantity: 1; Number of Terminations: 2; Termination: SMD/SMT; Max Power Dissipation: 125mW; Features: Moisture Resistant; Series: RC; Construction: Rectangular; Resistance Tolerance: 1%; Technology: THICK FILM; Length: 2mm; Width: 0.049inch; Height: 0.024inch; Depth: 1.25mm; Lead Pitch: 0.4mm; REACH SVHC: Unknown; Lead Free: Lead Free; Military Standard: Not; ComponentLink1URL: http://www.yageo.com/documents/recent/PYu-RC_Group_51_RoHS_L_10.pdf?src-supplier=Digi-Key; ComponentLink1Description: http://www.yageo.com/documents/recent/PYu-RC_Group_51_RoHS_L_10.pdf?src-supplier=Digi-Key; ComponentLink2URL: http://www.yageo.com/documents/recent/PYu-RC_Group_51_RoHS_L_9.pdf?src-supplier=Mouser; ComponentLink2Description: http://www.yageo.com/documents/recent/PYu-RC_Group_51_RoHS_L_9.pdf?src-supplier=Mouser; ComponentLink3URL: http://documents.rs-components.com/techlib://itc_doclist_GB.htm?stockno=6185113&src-supplier=RSComponents; ComponentLink3Description: http://documents.rs-components.com/techlib://itc_doclist_GB.htm?stockno=6185113&src-supplier=RSComponents; ComponentLink4URL: http://www.yageo.ru/pdf/RC0805.pdf?src-supplier=Future+Electronics; ComponentLink4Description: http://www.yageo.ru/pdf/RC0805.pdf?src-supplier=Future+Electronics; ComponentLink5URL: http://www.farnell.com/datasheets/38627.pdf?src-supplier=Element14; ComponentLink5Description: http://www.farnell.com/datasheets/38627.pdf?src-supplier=Element14; ComponentLink6URL: http://www.farnell.com/datasheets/2167052.pdf?src-supplier=Element14; ComponentLink6Description: http://www.farnell.com/datasheets/2167052.pdf?src-supplier=Element14; ComponentLink7URL: http://www.farnell.com/datasheets/1686128.pdf?src-supplier=Element14; ComponentLink7Description: http://www.farnell.com/datasheets/1686128.pdf?src-supplier=Element14; ComponentLink8URL: http://www.farnell.com/datasheets/444164.pdf?src-supplier=Element14; ComponentLink8Description: http://www.farnell.com/datasheets/444164.pdf?src-supplier=Element14; Supplier Part Number 1: 311-100KCRCT-ND
R2 R3 R18 R20 = RC0805FR-07560RL: Surface Mount Thick Film Resistor, RC Series, 560 ohm, 125 mW, - 1%, 150 V, 0805 [2012 Metric]; Manufacturer: Yageo; Resistance: 560R; Temperature Coefficient: 100ppm/°C; Power Rating: 125mW; Voltage Rating: 150V; Supplier 1: Digi-Key; Manufacturer Part Number: RC0805FR-07560RL; Stock 1: 237286; Pricing 1: 1=0.1, 10=0.036, 100=0.0147, 1000=0.0066, 2500=0.00573 (USD); Case/Package: 0805; Case Code (Metric): 2012; Case Code (Imperial): 0805; Weight: 0.000194oz; Size Code: 0805; Min Operating Temperature: -55°C; Max Operating Temperature: 155°C; Resistor Type: Thick Film; Tolerance: 1%; Package Quantity: 1; Packaging: Tape and Reel; Number of Terminations: 2; Termination: SMD/SMT; Max Power Dissipation: 125mW; Features: Moisture Resistant; Series: RC; Resistance Tolerance: 1%; Construction: Rectangular; Length: 2mm; Width: 0.049inch; Height: 0.024inch; Depth: 1.25mm; REACH SVHC: Unknown; Military Standard: Not; Lead Free: Lead Free; ComponentLink1URL: http://www.yageo.com/documents/recent/PYu-RC_Group_51_RoHS_L_10.pdf?src-supplier=Digi-Key; ComponentLink1Description: http://www.yageo.com/documents/recent/PYu-RC_Group_51_RoHS_L_10.pdf?src-supplier=Digi-Key; ComponentLink2URL: http://www.yageo.com/documents/recent/PYu-RC_Group_51_RoHS_L_9.pdf?src-supplier=Mouser; ComponentLink2Description: http://www.yageo.com/documents/recent/PYu-RC_Group_51_RoHS_L_9.pdf?src-supplier=Mouser; ComponentLink3URL: http://www.farnell.com/datasheets/2167052.pdf?src-supplier=Element14; ComponentLink3Description: http://www.farnell.com/datasheets/2167052.pdf?src-supplier=Element14; Supplier Part Number 1: 311-560CRCT-ND
R4 R5 R7 R11 = RC0805JR-070RL: Surface Mount Thick Film Resistor, RC Series, 125 mW, - 5%, 150 V, 0805 [2012 Metric]; Manufacturer: Yageo; Resistance: 0mR; Power Rating: 125mW; Voltage Rating: 150V; Temperature Coefficient: 200ppm/°C; Supplier 1: Digi-Key; Manufacturer Part Number: RC0805JR-070RL; Stock 1: 4064501; Pricing 1: 1=0.1, 10=0.031, 25=0.0224, 50=0.0172, 100=0.0126, 250=0.00964, 500=0.0077, 1000=0.00567 (USD); Case/Package: 0805; Number of Pins: 2; Contact Plating: Tin,Matte; Case Code (Imperial): 0805; Case Code (Metric): 2012; Size Code: 0805; Min Operating Temperature: -55°C; Max Operating Temperature: 155°C; Resistor Type: Thick Film; Tolerance: 5%; Packaging: Tape and Reel; Voltage Rating (DC): 150V; Termination: SMD/SMT; Features: Moisture Resistant; Series: RC; Max Power Dissipation: 125mW; Number of Terminations: 2; Construction: Rectangular; Technology: THICK FILM; Resistance Tolerance: 5%; Length: 2mm; Width: 1.25mm; Height: 0.5mm; Depth: 1.25mm; Radiation Hardening: No; REACH SVHC: Unknown; Military Standard: Not; Lead Free: Lead Free; ComponentLink1URL: http://www.farnell.com/datasheets/2167052.pdf?src-supplier=Element14; ComponentLink1Description: http://www.farnell.com/datasheets/2167052.pdf?src-supplier=Element14; ComponentLink2URL: http://documents.rs-components.com/techlib://itc_doclist_GB.htm?stockno=6185129&src-supplier=RSComponents; ComponentLink2Description: http://documents.rs-components.com/techlib://itc_doclist_GB.htm?stockno=6185129&src-supplier=RSComponents; ComponentLink3URL: https://www.verical.com/server-webapp/html/getDatasheet?partID=330685&src-supplier=Verical; ComponentLink3Description: https://www.verical.com/server-webapp/html/getDatasheet?partID=330685&src-supplier=Verical; Supplier Part Number 1: 311-0.0ARCT-ND
R6 R17 R22 = RC0805FR-07100KL: YAGEO         RC0805FR-07100KL            RES, THICK FILM, 100K, 1%, 0.125W, 0805, REEL; Resistance: 100kR; Temperature Coefficient: 100ppm/°C; Power Rating: 125mW; Voltage Rating: 150V; Supplier 1: Digi-Key; Manufacturer: Yageo; Manufacturer Part Number: RC0805FR-07100KL; Stock 1: 2366244; Pricing 1: 1=0.1, 10=0.036, 100=0.0147, 1000=0.0066, 2500=0.00573 (USD); Case/Package: 0805; Number of Pins: 2; Case Code (Metric): 2012; Case Code (Imperial): 0805; Size Code: 0805; Min Operating Temperature: -55°C; Max Operating Temperature: 155°C; Tolerance: 1%; Packaging: Tape and Reel; Resistor Type: Thick Film; Voltage Rating (DC): 150V; Package Quantity: 1; Number of Terminations: 2; Termination: SMD/SMT; Max Power Dissipation: 125mW; Features: Moisture Resistant; Series: RC; Construction: Rectangular; Resistance Tolerance: 1%; Technology: THICK FILM; Length: 2mm; Width: 0.049inch; Height: 0.024inch; Depth: 1.25mm; Lead Pitch: 0.4mm; REACH SVHC: Unknown; Lead Free: Lead Free; Military Standard: Not; ComponentLink1URL: http://www.yageo.com/documents/recent/PYu-RC_Group_51_RoHS_L_10.pdf?src-supplier=Digi-Key; ComponentLink1Description: http://www.yageo.com/documents/recent/PYu-RC_Group_51_RoHS_L_10.pdf?src-supplier=Digi-Key; ComponentLink2URL: http://www.yageo.com/documents/recent/PYu-RC_Group_51_RoHS_L_9.pdf?src-supplier=Mouser; ComponentLink2Description: http://www.yageo.com/documents/recent/PYu-RC_Group_51_RoHS_L_9.pdf?src-supplier=Mouser; ComponentLink3URL: http://documents.rs-components.com/techlib://itc_doclist_GB.htm?stockno=6185113&src-supplier=RSComponents; ComponentLink3Description: http://documents.rs-components.com/techlib://itc_doclist_GB.htm?stockno=6185113&src-supplier=RSComponents; ComponentLink4URL: http://www.yageo.ru/pdf/RC0805.pdf?src-supplier=Future+Electronics; ComponentLink4Description: http://www.yageo.ru/pdf/RC0805.pdf?src-supplier=Future+Electronics; ComponentLink5URL: http://www.farnell.com/datasheets/38627.pdf?src-supplier=Element14; ComponentLink5Description: http://www.farnell.com/datasheets/38627.pdf?src-supplier=Element14; ComponentLink6URL: http://www.farnell.com/datasheets/2167052.pdf?src-supplier=Element14; ComponentLink6Description: http://www.farnell.com/datasheets/2167052.pdf?src-supplier=Element14; ComponentLink7URL: http://www.farnell.com/datasheets/1686128.pdf?src-supplier=Element14; ComponentLink7Description: http://www.farnell.com/datasheets/1686128.pdf?src-supplier=Element14; ComponentLink8URL: http://www.farnell.com/datasheets/444164.pdf?src-supplier=Element14; ComponentLink8Description: http://www.farnell.com/datasheets/444164.pdf?src-supplier=Element14; Supplier Part Number 1: 311-100KCRCT-ND
R8-R10 R16 R25-R28 = RC0805FR-072R2L: YAGEO         RC0805FR-072R2L             RES, THICK FILM, 2R2, 1%, 0.125W, 0805; Resistance: 2.2R; Power Rating: 125mW; Voltage Rating: 150V; Temperature Coefficient: 200ppm/°C; Supplier 1: Digi-Key; Manufacturer: Yageo; Manufacturer Part Number: RC0805FR-072R2L; Stock 1: 157807; Pricing 1: 1=0.1, 10=0.072, 100=0.0294, 1000=0.01322, 2500=0.01148 (USD); Case/Package: 0805; Number of Pins: 2; Case Code (Imperial): 0805; Case Code (Metric): 2012; Size Code: 0805; Min Operating Temperature: -55°C; Max Operating Temperature: 155°C; Tolerance: 1%; Packaging: Tape and Reel; Termination: SMD/SMT; Resistor Type: Thick Film; Features: Moisture Resistant; Series: RC; Max Power Dissipation: 125mW; Number of Terminations: 2; Construction: Rectangular; Resistance Tolerance: 1%; Technology: THICK FILM; Voltage Rating (DC): 150V; Length: 2mm; Width: 1.25mm; Height: 0.5mm; Depth: 1.25mm; REACH SVHC: No SVHC; Military Standard: Not; Lead Free: Lead Free; ComponentLink1URL: http://www.farnell.com/datasheets/444164.pdf?src-supplier=Element14; ComponentLink1Description: http://www.farnell.com/datasheets/444164.pdf?src-supplier=Element14; Supplier Part Number 1: 311-2.20CRCT-ND
R12 R19 = RC0805FR-071ML: Res Thick Film 0805 1M Ohm 1% 0.125W(1/8W) ±100ppm/C Epoxy SMD T/R; Manufacturer: Yageo Phycomp; Power Rating: 125mW; Temperature Coefficient: 100ppm/°C; Resistance: 1MR; Voltage Rating (DC): 150V; Supplier 1: Digi-Key; Manufacturer Part Number: RC0805FR-071ML; Stock 1: 2427436; Pricing 1: 1=0.1, 10=0.036, 100=0.0147, 1000=0.0066, 2500=0.00573 (USD); Mount: Surface Mount; Case/Package: 0805; Number of Pins: 2; Min Operating Temperature: -55°C; Max Operating Temperature: 155°C; Tolerance: 1%; Packaging: Cut Tape; Length: 2mm; Width: 1.25mm; Height: 0.5mm; Depth: 1.25mm; REACH SVHC: No SVHC; Lead Free: Lead Free; Supplier Part Number 1: 311-1.00MCRCT-ND
R13-R15 = RC0805FR-071KL: RESISTOR, 0805 1K 1%, FULL REEL; Product Range:YAGEO - RC Series; Resistance:1kohm; Power Rating:125mW; Resistance Tolerance:± 1%; Resistor Case Style:0805 [2012 Metric]; Resistor Element Material:Thick Film; Temperature Coefficient:± 250ppm/°C; Voltage Rating:150V; Packaging:Tape & Reel; MSL:-; SVHC:No SVHC (16-Dec-2013); External Depth:0.55mm; External Length / Height:2mm; External Width:1.25mm; No. of Pins:2; Operating Temperature Max:155°C; Operating Temperature Min:-55°C; Operating Temperature Range:-55°C to +155°C; Reel Quantity:5000; Resistor Mounting:SMD; Series:RC12H; Temperature Coef; Manufacturer: Yageo; Resistance: 1kR; Power Rating: 125mW; Voltage Rating: 150V; Temperature Coefficient: 100ppm/°C; Supplier 1: Digi-Key; Manufacturer Part Number: RC0805FR-071KL; Stock 1: 14565891; Pricing 1: 1=0.1, 10=0.036, 100=0.0147, 1000=0.0066, 2500=0.00573 (USD); Case/Package: 0805; Number of Pins: 2; Case Code (Metric): 2012; Case Code (Imperial): 0805; Size Code: 0805; Min Operating Temperature: -55°C; Max Operating Temperature: 155°C; Package Quantity: 1; Tolerance: 1%; Packaging: Tape and Reel; Resistor Type: Thick Film; Number of Terminations: 2; Termination: SMD/SMT; Max Power Dissipation: 125mW; Features: Moisture Resistant; Series: RC; Resistance Tolerance: 1%; Construction: Rectangular; Voltage Rating (DC): 150V; Length: 0.079inch; Width: 0.049inch; Height: 0.024inch; Depth: 1.25mm; REACH SVHC: Unknown; Military Standard: Not; Lead Free: Lead Free; ComponentLink1URL: http://www.yageo.com/documents/recent/PYu-RC_Group_51_RoHS_L_10.pdf?src-supplier=Digi-Key; ComponentLink1Description: http://www.yageo.com/documents/recent/PYu-RC_Group_51_RoHS_L_10.pdf?src-supplier=Digi-Key; ComponentLink2URL: http://www.farnell.com/datasheets/1686128.pdf?src-supplier=Element14; ComponentLink2Description: http://www.farnell.com/datasheets/1686128.pdf?src-supplier=Element14; ComponentLink3URL: http://www.yageo.ru/pdf/RC0805.pdf?src-supplier=Future+Electronics; ComponentLink3Description: http://www.yageo.ru/pdf/RC0805.pdf?src-supplier=Future+Electronics; ComponentLink4URL: http://www.farnell.com/datasheets/2167052.pdf?src-supplier=Element14; ComponentLink4Description: http://www.farnell.com/datasheets/2167052.pdf?src-supplier=Element14; Supplier Part Number 1: 311-1.00KCRCT-ND
R21 R23 R24 = RC0805FR-0710KL: RES SMD 10K OHM 1% 1/8W 0805; Manufacturer: Yageo; Resistance: 10kR; Temperature Coefficient: 100ppm/°C; Power Rating: 125mW; Voltage Rating: 150V; Supplier 1: Digi-Key; Manufacturer Part Number: RC0805FR-0710KL; Stock 1: 15321414; Pricing 1: 1=0.1, 10=0.036, 100=0.0147, 1000=0.0066, 2500=0.00573 (USD); Case/Package: 0805; Case Code (Imperial): 0805; Case Code (Metric): 2012; Size Code: 0805; Min Operating Temperature: -55°C; Max Operating Temperature: 155°C; Tolerance: 1%; Resistor Type: Thick Film; Packaging: Tape and Reel; Package Quantity: 1; Termination: SMD/SMT; Number of Terminations: 2; Max Power Dissipation: 125mW; Features: Moisture Resistant; Series: RC; Construction: Rectangular; Resistance Tolerance: 1%; Technology: THICK FILM; Length: 2mm; Width: 0.049inch; Height: 0.024inch; Depth: 1.25mm; REACH SVHC: Unknown; Military Standard: Not; Lead Free: Lead Free; ComponentLink1URL: http://www.yageo.com/documents/recent/PYu-RC_Group_51_RoHS_L_9.pdf?src-supplier=Mouser; ComponentLink1Description: http://www.yageo.com/documents/recent/PYu-RC_Group_51_RoHS_L_9.pdf?src-supplier=Mouser; ComponentLink2URL: http://www.farnell.com/datasheets/2167052.pdf?src-supplier=Element14; ComponentLink2Description: http://www.farnell.com/datasheets/2167052.pdf?src-supplier=Element14; ComponentLink3URL: http://www.yageo.com/documents/recent/PYu-RC_Group_51_RoHS_L_10.pdf?src-supplier=Digi-Key; ComponentLink3Description: http://www.yageo.com/documents/recent/PYu-RC_Group_51_RoHS_L_10.pdf?src-supplier=Digi-Key; ComponentLink4URL: http://www.yageo.ru/pdf/RC0805.pdf?src-supplier=Future+Electronics; ComponentLink4Description: http://www.yageo.ru/pdf/RC0805.pdf?src-supplier=Future+Electronics; Supplier Part Number 1: 311-10.0KCRCT-ND
SCKT-FOR-U1 = 7010501790: Conn IC DIP Socket 28POS Tin; Manufacturer: 3M; Supplier 1: Digi-Key; Manufacturer Part Number: 7010501790; Stock 1: 0; Pricing 1: 1=0.79, 10=0.693, 25=0.6524, 50=0.6254, 100=0.5982, 250=0.5438, 500=0.48942, 1000=0.43504, 2500=0.39426 (USD); Supplier Part Number 1: 3M5480-ND